# Altium project DC075B.PrjPcb (part 3 of 7)

## Sheet DC075B_LMK_CLOCK_CIRCUIT.SchDoc: LMK CLOCK CIRCUIT
size 558 x 431 mm; DrawnBy: Praveen Aroul; DocumentNumber: 4; SheetNumber: 4; SheetTotal: 13; PageSetup: Record=PageOptions|CenterHorizontal=True|CenterVertical=True|PrintScale=1.00|XCorrection=1.00|YCorrection=1.00|PrintKind=0|BorderSize=5000000|LeftOffset=0|BottomOffset=0|Orientation=2|PaperLength=1000|PaperWidth=1000|Scale=100|PaperSource=15|PrintQuality=600|MediaType=1|DitherType=10|PaperKind=Letter|PrintScaleMode=1
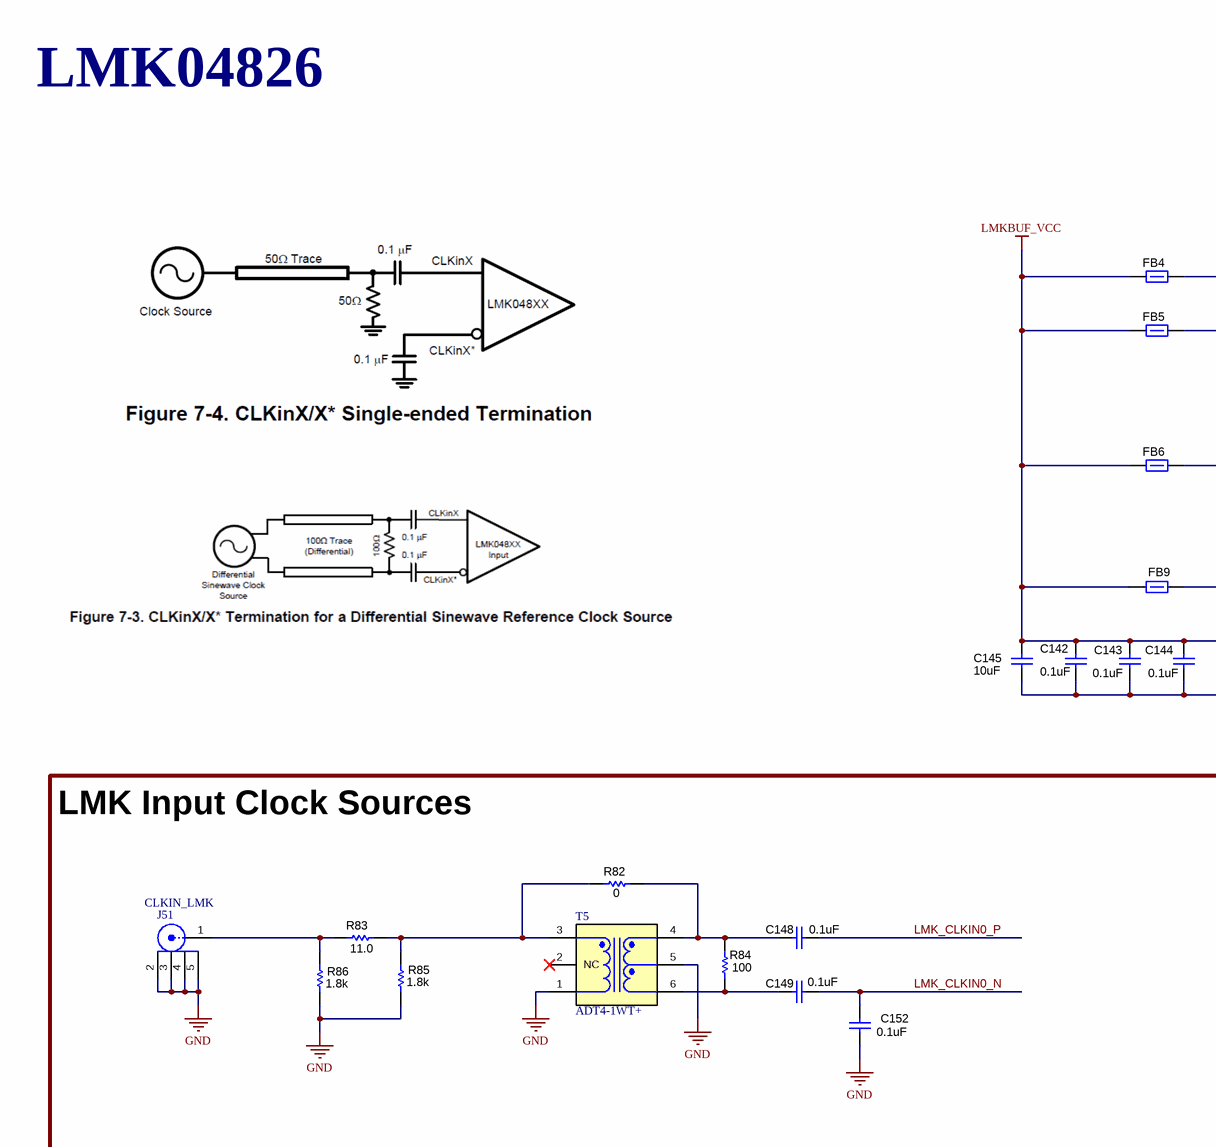
[diagram p7: DC075B_LMK_CLOCK_CIRCUIT.SchDoc, top left]
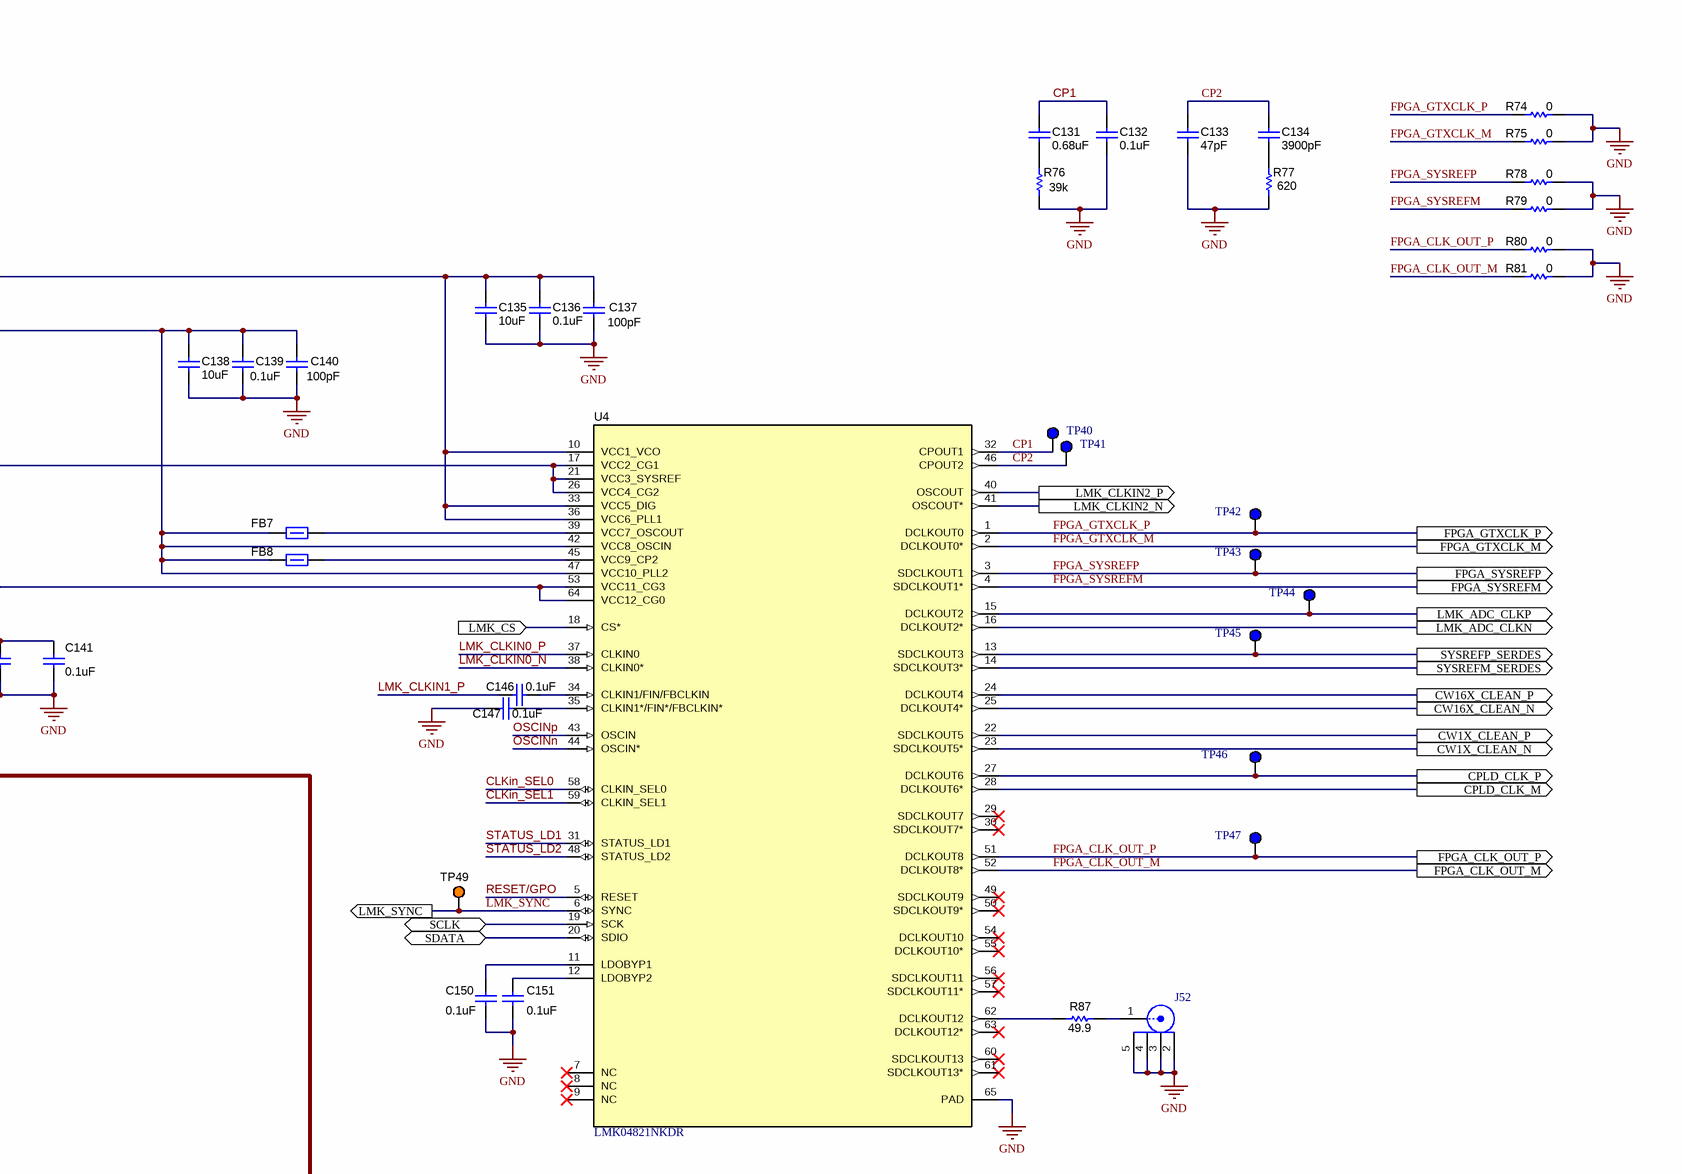
[diagram p8: DC075B_LMK_CLOCK_CIRCUIT.SchDoc, top right]
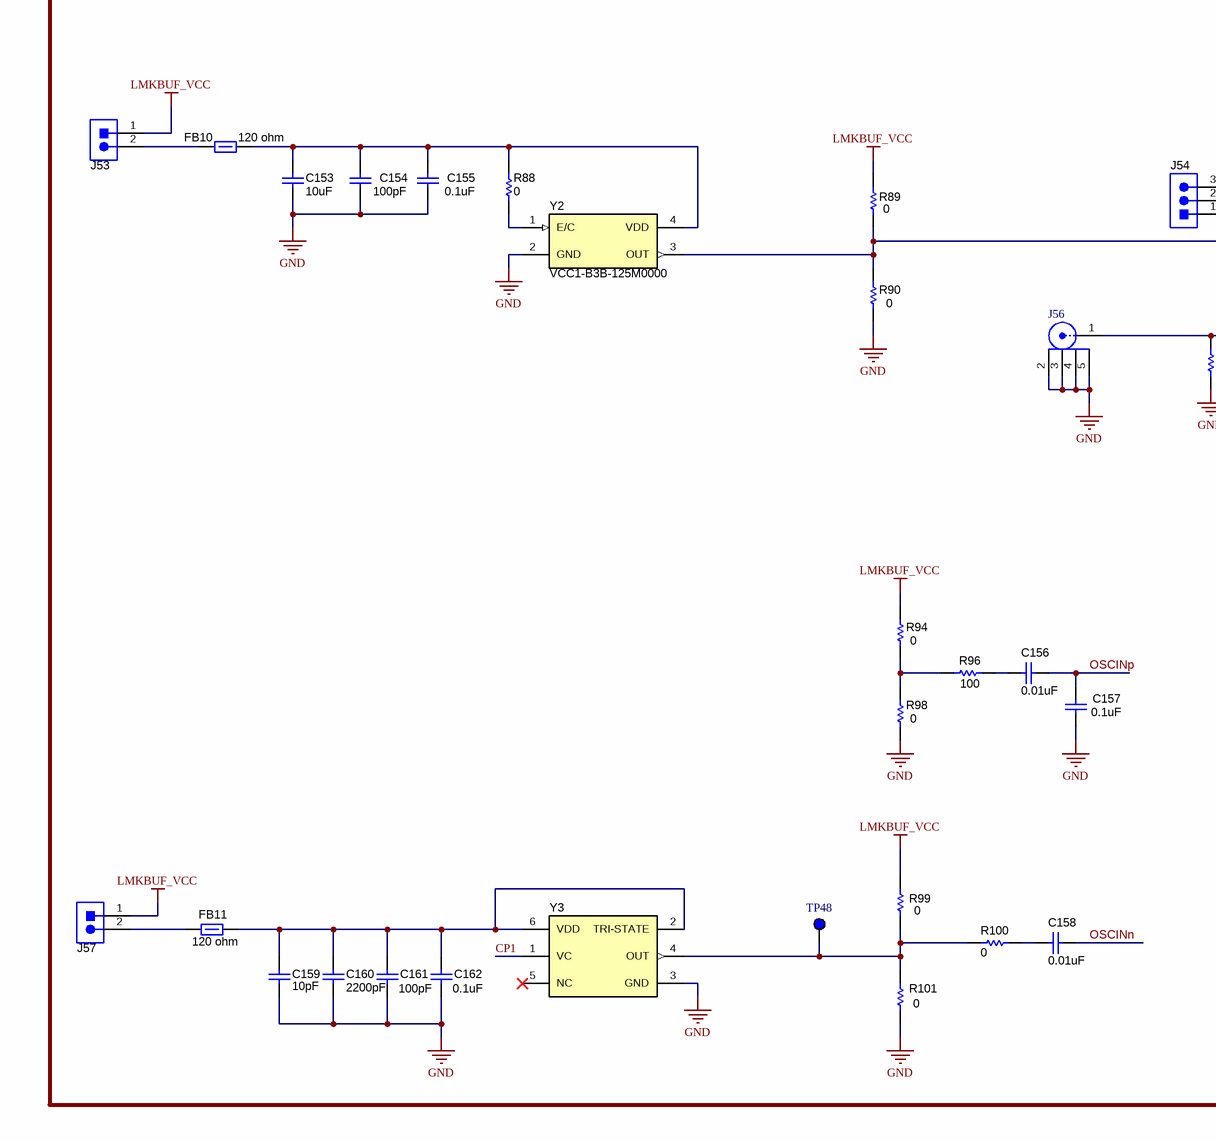
[diagram p9: DC075B_LMK_CLOCK_CIRCUIT.SchDoc, bottom left]
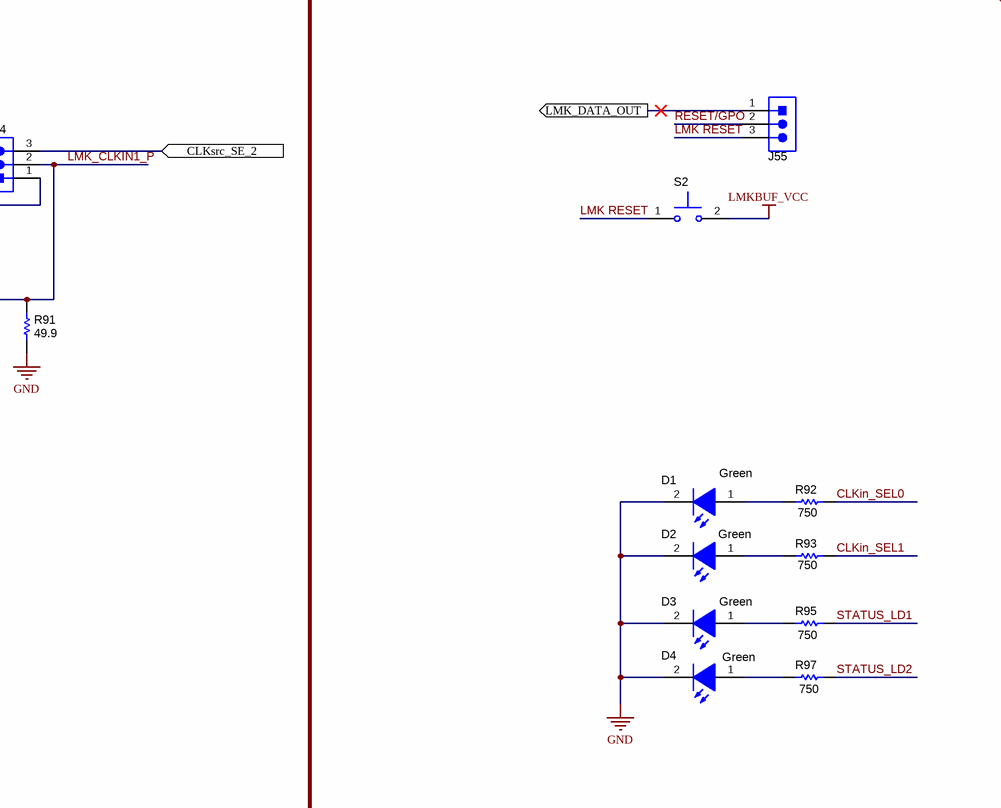
[diagram p10: DC075B_LMK_CLOCK_CIRCUIT.SchDoc, bottom right]

### Parts
C131  value 0.68uF  [0603_HV]  (hidden comment: C0603C684K8PACTU)
C132  value 0.1uF  [0402]  (hidden comment: GRM155R71C104KA88D)
C133  ValueDisplayed: 47pF  [0603]  (hidden comment: C0603C470J1GACAUTO)
C134  value 3900pF  [0402]  (hidden comment: CL05B392KB5NNNC)
C135  value 10uF  [0603_HV]  (hidden comment: GRM188R60J106ME47D)
C136  value 0.1uF  [0402]  (hidden comment: GRM155R71C104KA88D)
C137  value 100pF  [0402]  (hidden comment: CC0402KRX7R9BB101)
C138  value 10uF  [0603_HV]  (hidden comment: GRM188R60J106ME47D)
C139  value 0.1uF  [0402]  (hidden comment: GRM155R71C104KA88D)
C140  value 100pF  [0402]  (hidden comment: CC0402KRX7R9BB101)
C141  value 0.1uF  [0402]  (hidden comment: GRM155R71C104KA88D)
C142  value 0.1uF  [0402]  (hidden comment: GRM155R71C104KA88D)
C143  value 0.1uF  [0402]  (hidden comment: GRM155R71C104KA88D)
C144  value 0.1uF  [0402]  (hidden comment: GRM155R71C104KA88D)
C145  value 10uF  [0603_HV]  (hidden comment: GRM188R60J106ME47D)
C146  value 0.1uF  [0402]  (hidden comment: GRM155R71C104KA88D)
C147  value 0.1uF  [0402]  (hidden comment: GRM155R71C104KA88D)
C148  value 0.1uF  [0402]  (hidden comment: GRM155R71C104KA88D)
C149  value 0.1uF  [0402]  (hidden comment: GRM155R71C104KA88D)
C150  value 0.1uF  [0402]  (hidden comment: GRM155R71C104KA88D)
C151  value 0.1uF  [0402]  (hidden comment: GRM155R71C104KA88D)
C152  value 0.1uF  [0603_HV]  (hidden comment: 06033C104JAT2A)
C153  value 10uF  [0603_HV]  (hidden comment: GRM188R60J106ME47D)
C154  value 100pF  [0402]  (hidden comment: CC0402KRX7R9BB101)
C155  value 0.1uF  [0402]  (hidden comment: GRM155R71C104KA88D)
C156  ValueDisplayed: 0.01uF  [0402]  (hidden comment: GRM155R61C103KA01D)
C157  value 0.1uF  [0402]  (hidden comment: GRM155R71C104KA88D)
C158  ValueDisplayed: 0.01uF  [0402]  (hidden comment: GRM155R61C103KA01D)
C159  ValueDisplayed: 10pF  [0402]  (hidden comment: C0402C100C8GACTU)
C160  ValueDisplayed: 2200pF  [0402_065]  (hidden comment: 500R07W222KV4T)
C161  value 100pF  [0402]  (hidden comment: CC0402KRX7R9BB101)
C162  value 0.1uF  [0402]  (hidden comment: GRM155R71C104KA88D)
D1  value Green  [LED_LTST-C190_G]  (hidden comment: LTST-C190KGKT)
D2  value Green  [LED_LTST-C190_G]  (hidden comment: LTST-C190KGKT)
D3  value Green  [LED_LTST-C190_G]  (hidden comment: LTST-C190KGKT)
D4  value Green  [LED_LTST-C190_G]  (hidden comment: LTST-C190KGKT)
FB4  BLM21AG121SN1D  [0805]  (value not drawn)
FB5  BLM21AG121SN1D  [0805]  (value not drawn)
FB6  BLM21AG121SN1D  [0805]  (value not drawn)
FB7  BLM21AG121SN1D  [0805]  (value not drawn)
FB8  BLM21AG121SN1D  [0805]  (value not drawn)
FB9  BLM21AG121SN1D  [0805]  (value not drawn)
FB10  value 120 ohm  [1206]  (hidden comment: HI1206P121R-10)
FB11  value 120 ohm  [1206]  (hidden comment: HI1206P121R-10)
J51  5-1814832-1  [TE_5-1814832-1]  (value not drawn)
J52  5-1814832-1  [TE_5-1814832-1]  (value not drawn)
J53  TSW-102-07-G-S  [TSW-102-07-G-S]  (value not drawn)
J54  TSW-103-07-G-S  [TSW-103-07-G-S]  (value not drawn)
J55  TSW-103-07-G-S  [TSW-103-07-G-S]  (value not drawn)
J56  5-1814832-1  [TE_5-1814832-1]  (value not drawn)
J57  TSW-102-07-G-S  [TSW-102-07-G-S]  (value not drawn)
R74  value 0  [0402]  (hidden comment: CRCW04020000Z0ED)
R75  value 0  [0402]  (hidden comment: CRCW04020000Z0ED)
R76  value 39k  [0402]  (hidden comment: CRCW040239K0JNED)
R77  value 620  [0402]  (hidden comment: CRCW0402620RJNED)
R78  value 0  [0402]  (hidden comment: CRCW04020000Z0ED)
R79  value 0  [0402]  (hidden comment: CRCW04020000Z0ED)
R80  value 0  [0402]  (hidden comment: CRCW04020000Z0ED)
R81  value 0  [0402]  (hidden comment: CRCW04020000Z0ED)
R82  value 0  [0402]  (hidden comment: CRCW04020000Z0ED)
R83  value 11.0  [0402]  (hidden comment: CRCW040211R0FKED)
R84  ValueDisplayed: 100  [0402]  (hidden comment: ERJ-2RKF1000X)
R85  value 1.8k  [0402]  (hidden comment: CRCW04021K80JNED)
R86  value 1.8k  [0402]  (hidden comment: CRCW04021K80JNED)
R87  value 49.9  [0402]  (hidden comment: CRCW040249R9FKED)
R88  ValueDisplayed: 0  [0402]  (hidden comment: CRCW04020000Z0ED)
R89  value 0  [0402]  (hidden comment: CRCW04020000Z0ED)
R90  value 0  [0402]  (hidden comment: CRCW04020000Z0ED)
R91  value 49.9  [0402]  (hidden comment: CRCW040249R9FKED)
R92  value 750  [0402]  (hidden comment: CRCW0402750RJNED)
R93  value 750  [0402]  (hidden comment: CRCW0402750RJNED)
R94  value 0  [0402]  (hidden comment: CRCW04020000Z0ED)
R95  value 750  [0402]  (hidden comment: CRCW0402750RJNED)
R96  ValueDisplayed: 100  [0402]  (hidden comment: ERJ-2RKF1000X)
R97  value 750  [0402]  (hidden comment: CRCW0402750RJNED)
R98  value 0  [0402]  (hidden comment: CRCW04020000Z0ED)
R99  value 0  [0402]  (hidden comment: CRCW04020000Z0ED)
R100  ValueDisplayed: 0  [0402]  (hidden comment: CRCW04020000Z0ED)
R101  value 0  [0402]  (hidden comment: CRCW04020000Z0ED)
S2  SKRKAEE020  [SW_SKRKAE]  (value not drawn)
T5  ADT4-1WT+  [MNC_CD542]
TP40  5117  [Keystone5117]  (value not drawn)
TP41  5117  [Keystone5117]  (value not drawn)
TP42  5117  [Keystone5117]  (value not drawn)
TP43  5117  [Keystone5117]  (value not drawn)
TP44  5117  [Keystone5117]  (value not drawn)
TP45  5117  [Keystone5117]  (value not drawn)
TP46  5117  [Keystone5117]  (value not drawn)
TP47  5117  [Keystone5117]  (value not drawn)
TP48  5117  [Keystone5117]  (value not drawn)
TP49  5003  [Keystone5003]  (value not drawn)
U4  LMK04821NKDR  [NKD0064A]
Y2  VCC1-B3B-125M0000  [Vectron_VCC1]
Y3  ASVV-40.000MHZ-N102-T  [ABRACON_ASVV]  (value not drawn)

### Blocks framed on the sheet
LMK Input Clock Sources: C148 C149 C152-C162 FB10 FB11 J51 J53 J54 J56 J57 R82-R86 R88-R91 R94 R96 R98-R101 T5 TP48 Y2 Y3

### Ports
CLKsrc_SE_2 (in), CPLD_CLK_M (out), CPLD_CLK_P (out), CW1X_CLEAN_N (out), CW1X_CLEAN_P (out), CW16X_CLEAN_N (out), CW16X_CLEAN_P (out), FPGA_CLK_OUT_M (out), FPGA_CLK_OUT_P (out), FPGA_GTXCLK_M (out), FPGA_GTXCLK_P (out), FPGA_SYSREFM (out), FPGA_SYSREFP (out), LMK_ADC_CLKN (out), LMK_ADC_CLKP (out), LMK_CLKIN2_N (out), LMK_CLKIN2_P (out), LMK_CS (in), LMK_DATA_OUT (out), LMK_SYNC (out), SCLK, SDATA (bidir), SYSREFM_SERDES (out), SYSREFP_SERDES (out)

### Nets
GND: C132.1 C133.1 C135.1 C136.1 C137.1 C138.1 C139.1 C140.1 C141.1 C142.1 C143.1 C144.1 C145.1 C147.2 C150.2 C151.2 C152.2 C153.2 C154.2 C155.2 C157.2 C159.2 C160.2 C161.2 C162.2 D1.2(K) D2.2(K) D3.2(K) D4.2(K) J51.2 J51.3 J51.4 J51.5 J52.2 J52.3 J52.4 J52.5 J56.2 J56.3 J56.4 J56.5 R74.2 R75.1 R76.1 R77.1 R78.2 R79.1 R80.2 R81.1 R85.2 R86.2 R90.2 R91.2 R98.2 R101.2 T5.1 T5.5 U4.65(PAD) Y2.2(GND) Y3.3(GND)
LMKBUF_VCC: C141.2 C142.2 C143.2 C144.2 C145.2 FB4.1 FB5.1 FB6.1 FB9.1 J53.1 J57.1 R89.1 R94.1 R99.1 S2.2
CLKin_SEL0: R92.2 U4.58(CLKIN_SEL0)
CLKin_SEL1: R93.2 U4.59(CLKIN_SEL1)
CLKsrc_SE_2: J54.3 ; port CLKsrc_SE_2
CP1: C131.2 C132.2 TP40.1 U4.32(CPOUT1) Y3.1(VC)
CP2: C133.2 C134.2 TP41.1 U4.46(CPOUT2)
CPLD_CLK_M: U4.28(DCLKOUT6*) ; port CPLD_CLK_M
CPLD_CLK_P: TP46.1 U4.27(DCLKOUT6) ; port CPLD_CLK_P
CW1X_CLEAN_N: U4.23(SDCLKOUT5*) ; port CW1X_CLEAN_N
CW1X_CLEAN_P: U4.22(SDCLKOUT5) ; port CW1X_CLEAN_P
CW16X_CLEAN_N: U4.25(DCLKOUT4*) ; port CW16X_CLEAN_N
CW16X_CLEAN_P: U4.24(DCLKOUT4) ; port CW16X_CLEAN_P
FPGA_CLK_OUT_M: R81.2 U4.52(DCLKOUT8*) ; port FPGA_CLK_OUT_M
FPGA_CLK_OUT_P: R80.1 TP47.1 U4.51(DCLKOUT8) ; port FPGA_CLK_OUT_P
FPGA_GTXCLK_M: R75.2 U4.2(DCLKOUT0*) ; port FPGA_GTXCLK_M
FPGA_GTXCLK_P: R74.1 TP42.1 U4.1(DCLKOUT0) ; port FPGA_GTXCLK_P
FPGA_SYSREFM: R79.2 U4.4(SDCLKOUT1*) ; port FPGA_SYSREFM
FPGA_SYSREFP: R78.1 TP43.1 U4.3(SDCLKOUT1) ; port FPGA_SYSREFP
LMK RESET: J55.3 S2.1
LMK_ADC_CLKN: U4.16(DCLKOUT2*) ; port LMK_ADC_CLKN
LMK_ADC_CLKP: TP44.1 U4.15(DCLKOUT2) ; port LMK_ADC_CLKP
LMK_CLKIN0_N: C149.2 C152.1 U4.38(CLKIN0*)
LMK_CLKIN0_P: C148.2 U4.37(CLKIN0)
LMK_CLKIN1_P: C146.2 J54.2 J56.1 R91.1
LMK_CLKIN2_N: U4.41(OSCOUT*) ; port LMK_CLKIN2_N
LMK_CLKIN2_P: U4.40(OSCOUT) ; port LMK_CLKIN2_P
LMK_CS: U4.18(CS*) ; port LMK_CS
LMK_DATA_OUT: J55.1 ; port LMK_DATA_OUT
LMK_SYNC: TP49.1 U4.6(SYNC) ; port LMK_SYNC
OSCINn: C158.1 U4.44(OSCIN*)
OSCINp: C156.1 C157.1 U4.43(OSCIN)
RESET/GPO: J55.2 U4.5(RESET)
SCLK: U4.19(SCK) ; port SCLK
SDATA: U4.20(SDIO) ; port SDATA
STATUS_LD1: R95.2 U4.31(STATUS_LD1)
STATUS_LD2: R97.2 U4.48(STATUS_LD2)
SYSREFM_SERDES: U4.14(SDCLKOUT3*) ; port SYSREFM_SERDES
SYSREFP_SERDES: TP45.1 U4.13(SDCLKOUT3) ; port SYSREFP_SERDES
NetC131_1: C131.1 R76.2
NetC134_1: C134.1 R77.2
NetC135_2: C135.2 C136.2 C137.2 FB4.2 U4.10(VCC1_VCO) U4.33(VCC5_DIG) U4.36(VCC6_PLL1)
NetC138_2: C138.2 C139.2 C140.2 FB5.2 FB7.1 FB8.1 U4.42(VCC8_OSCIN) U4.47(VCC10_PLL2)
NetC146_1: C146.1 U4.34(CLKIN1/FIN/FBCLKIN)
NetC147_1: C147.1 U4.35(CLKIN1*/FIN*/FBCLKIN*)
NetC148_1: C148.1 R82.2 R84.2 T5.4
NetC149_1: C149.1 R84.1 T5.6
NetC150_1: C150.1 U4.11(LDOBYP1)
NetC151_1: C151.1 U4.12(LDOBYP2)
NetC153_1: C153.1 C154.1 C155.1 FB10.2 R88.1 Y2.4(VDD)
NetC156_2: C156.2 R96.1
NetC158_2: C158.2 R100.1
NetC159_1: C159.1 C160.1 C161.1 C162.1 FB11.2 Y3.2(TRI-STATE) Y3.6(VDD)
NetD1_1: D1.1(A) R92.1
NetD2_1: D2.1(A) R93.1
NetD3_1: D3.1(A) R95.1
NetD4_1: D4.1(A) R97.1
NetFB6_2: FB6.2 U4.17(VCC2_CG1) U4.21(VCC3_SYSREF) U4.26(VCC4_CG2)
NetFB7_2: FB7.2 U4.39(VCC7_OSCOUT)
NetFB8_2: FB8.2 U4.45(VCC9_CP2)
NetFB9_2: FB9.2 U4.53(VCC11_CG3) U4.64(VCC12_CG0)
NetFB10_1: FB10.1 J53.2
NetFB11_1: FB11.1 J57.2
NetJ51_1: J51.1 R83.1 R86.1
NetJ52_1: J52.1 R87.2
NetJ54_1: J54.1 R89.2 R90.1 Y2.3(OUT)
NetR82_1: R82.1 R83.2 R85.1 T5.3
NetR87_1: R87.1 U4.62(DCLKOUT12)
NetR88_2: R88.2 Y2.1(E/C)
NetR94_2: R94.2 R96.2 R98.1
NetR99_2: R99.2 R100.2 R101.1 TP48.1 Y3.4(OUT)

Not connected (* = marked no-connect by the designer): T5 2(NC)*; U4 7(NC)* 8(NC)* 9(NC)* 29(SDCLKOUT7)* 30(SDCLKOUT7*)* 49(SDCLKOUT9)* 50(SDCLKOUT9*)* 54(DCLKOUT10)* 55(DCLKOUT10*)* 56(SDCLKOUT11)* 57(SDCLKOUT11*)* 60(SDCLKOUT13)* 61(SDCLKOUT13*)* 63(DCLKOUT12*)*; Y3 5(NC)*

### Notes on the sheet
- LMK04826
- (near J51) CLKIN_LMK
- Drawn By:
- SVN Rev:
- Number:
- TID #:
- Orderable:
- Rev:
- Sheet Title:
- File:
- Project Title:
- Designed for:
- Assembly Variant:
- Mod. Date:
- Sheet:
- Size:
- of
- C
- http://www.ti.com
- Texas Instruments and/or its licensors do not warrant the accuracy or completeness of this specification or any information contained therein. Texas Instruments and/or its licensors do not warrant that this design will meet the specifications, will be suitable for your application or fit for any particular purpose, or will operate in an implementation. Texas Instruments and/or its licensors do not warrant that the design is production worthy. You should completely validate and test your design implementation to confirm the system functionality for your application.
- Engineer:
- Contact:
- © Texas Instruments

### Library data of the parts
C131 = CMP-0006965-5: CAP, CERM, 0.68 uF, 10 V, +/- 10%, X5R, 0603; Manufacturer: Kemet; Polarized: N; U/M: EA; Cap_F: 680nF; Value1: Unknown; VDC_V: 10V; TaMin_C: -55°C; TaMax_C: 85°C; Cap_Case: 0603; AEC Category: Q200; SizeArea_mm2: 1.28; SizeAreaWB_mm2: 4.68; SizeX_mm: 1.6; SizeY_mm: 0.8; SizeZ_mm: 1; CompType: Capacitor; PartNumber: C0603C684K8PACTU; PackageReference: 0603; RoHS: Y; MountType: SMT; ComponentLink1Description: Datasheet link; ComponentLink1URL: http://www.kemet.com/kemet/web/homepage/kechome.nsf/vapubfiles/F3102_Y5V.pdf/$file/F3102_Y5V.pdf; ValueDisplayed: 0.68uF; Tolerance_%: 10%; Value2: 10V; Technology: Ceramic; TempCo: X5R; Published: 2008-06-19; Publisher: Texas Instruments; LatestRevisionDate: 2017-03-09; Supplier 1: Digi-Key; Supplier Part Number 1: 399-3116-1-ND; Supplier 2: Mouser; Supplier Part Number 2: 80-C0603C684K8P; AEC Qualified: ?
C132 C136 C139 C141-C144 C146-C151 C155 C157 C162 = CMP-0006641-2: as C210 on sheet DC075B_USB; CompType: Capacitor; PartNumber: GRM155R71C104KA88D; PackageReference: 0402; RoHS: Y; MountType: SMT; ComponentLink1Description: Datasheet link; ComponentLink1URL: http://search.murata.co.jp/Ceramy/PnsearchViewAction.do?HnOFG=ON&HnNFG=ON&SEL_CNT=50&sLang=en&sKey=GRM155R71C104KA88D&x=9&y=9&search=startwith; ValueDisplayed: 0.1uF; Tolerance_%: 10%; Value2: 16V; Technology: Ceramic; TempCo: X7R; Cap_Case: 0402; Published: 2008-06-19; Publisher: Texas Instruments; LatestRevisionDate: 2017-03-09; Supplier 1: Digi-Key; Supplier Part Number 1: 490-3261-1-ND; Supplier 2: Newark; Supplier Part Number 2: 38K1647; Supplier 3: Mouser; Supplier Part Number 3: 81-GRM155R71C104KA88; AEC Qualified: ?; SizeY_mm: 0.5
C133 = CMP-0085572-1: CAP, CERM, 47 pF, 100 V,+/- 5%, C0G/NP0, AEC-Q200 Grade 1, 0603; Manufacturer: Kemet; TaMax_C: 125°C; AEC Category: Q200; AEC Grade: 1; VDC_V: 100V; TaMin_C: -55°C; SizeArea_mm2: 1.28; CompType: Capacitor; Value: 47pF; AEC Qualified: Y; Polarized: N; SizeX_mm: 1.6; U/M: EA; SizeY_mm: 0.8; SizeAreaWB_mm2: 4.68; PartNumber: C0603C470J1GACAUTO; ComponentLink1Description: Datasheet link; SizeZ_mm: 1; MountType: SMT; Technology: Ceramic; ComponentLink1URL: https://api.kemet.com/component-edge/download/specsheet/C0603C470J1GACAUTO.pdf; Tolerance_%: 5%; Value2: 100V; TempCo: C0G/NP0; Cap_F: 47pF; PackageReference: 0603; Cap_Case: 0603; RoHS: Y
C134 = CMP-0085576-2: CAP, CERM, 3900 pF, 50 V,+/- 10%, X7R, 0402; Manufacturer: Samsung Electro-Mechanics; CompType: Capacitor; Polarized: N; U/M: EA; Cap_F: 3.9nF; VDC_V: 50V; TaMin_C: -55°C; TaMax_C: 125°C; AEC Category: Q200; SizeArea_mm2: 0.5; SizeAreaWB_mm2: 3; SizeX_mm: 1; SizeZ_mm: 0.6; PartNumber: CL05B392KB5NNNC; PackageReference: 0402; RoHS: Y; MountType: SMT; ComponentLink1Description: Datasheet link; ComponentLink1URL: http://www.samsungsem.com/kr/support/product-search/mlcc/__icsFiles/afieldfile/2018/07/26/CL05B392KB5NNNC.pdf; ValueDisplayed: 3900pF; Tolerance_%: 10%; Value2: 50V; Technology: Ceramic; TempCo: X7R; Cap_Case: 0402; AEC Grade: N/A; AEC Qualified: N; SizeY_mm: 0.5
C135 C138 C145 C153 = CMP-0007303-5: CAP, CERM, 10 uF, 6.3 V, +/- 20%, X5R, 0603; Manufacturer: MuRata; Polarized: N; U/M: EA; Cap_F: 10µF; ESR_ohm: 9m; Value1: 0.009 ohm; VDC_V: 6.3V; IRMS_A: 2.74A; TaMin_C: -55°C; TaMax_C: 125°C; Cap_Case: 0603; AEC Category: Q200; SizeArea_mm2: 1.28; SizeAreaWB_mm2: 4.68; SizeX_mm: 1.6; SizeY_mm: 0.8; SizeZ_mm: 1; CompType: Capacitor; PartNumber: GRM188R60J106ME47D; PackageReference: 0603; RoHS: Y; MountType: SMT; ComponentLink1Description: Datasheet link; ComponentLink1URL: http://www.murata.com/products/capacitor/tech_data/pdf/grm188r60j106m.pdf; ValueDisplayed: 10uF; Tolerance_%: 20%; Value2: 6.3V; Technology: Ceramic; TempCo: X5R; Published: 2008-06-19; Publisher: Texas Instruments; LatestRevisionDate: 2017-03-09; Supplier 1: Digi-Key; Supplier Part Number 1: 490-3896-1-ND; Supplier 2: Mouser; Supplier Part Number 2: 81-GRM188R60J106ME47; Supplier 3: Farnell; Supplier Part Number 3: 1735528; AEC Qualified: ?
C137 C140 C154 C161 = CMP-0006305-2: CAP, CERM, 100 pF, 50 V, +/- 10%, X7R, 0402; Manufacturer: Yageo America; Polarized: N; U/M: EA; Value1: Unknown; VDC_V: 50V; TaMin_C: -55°C; TaMax_C: 125°C; AEC Category: Q200; SizeArea_mm2: 0.5; SizeAreaWB_mm2: 3; SizeX_mm: 1; SizeZ_mm: 0.6; CompType: Capacitor; PartNumber: CC0402KRX7R9BB101; ValueDisplayed: 100pF; PackageReference: 0402; RoHS: Y; Cap_F: 100pF; Tolerance_%: 10%; Value2: 50V; MountType: SMT; Technology: Ceramic; TempCo: X7R; Cap_Case: 0402; Published: 2008-06-19; Publisher: Texas Instruments; LatestRevisionDate: 2017-03-09; ComponentLink1Description: Datasheet link; ComponentLink1URL: http://www.yageo.com/documents/recent/UPY-GPHC_X7R_6.3V-to-50V_9.pdf; Supplier 1: Digi-Key; Supplier Part Number 1: 311-1419-1-ND; Supplier 2: Newark; Supplier Part Number 2: 65R7701; Supplier 3: Mouser; Supplier Part Number 3: 603-CC402KRX7R9BB101; AEC Qualified: ?; SizeY_mm: 0.5
C152 = CMP-0006752-5: CAP, CERM, 0.1 uF, 25 V, +/- 5%, X7R, 0603; Manufacturer: AVX; Polarized: N; U/M: EA; Cap_F: 100nF; ESR_ohm: 0.05; Value1: 0.05 ohm; VDC_V: 25V; TaMin_C: -55°C; TaMax_C: 125°C; Cap_Case: 0603; AEC Category: Q200; SizeArea_mm2: 1.28; SizeAreaWB_mm2: 4.68; SizeX_mm: 1.6; SizeY_mm: 0.8; SizeZ_mm: 1; CompType: Capacitor; PartNumber: 06033C104JAT2A; PackageReference: 0603; RoHS: Y; MountType: SMT; ComponentLink1Description: Datasheet link; ComponentLink1URL: http://datasheets.avx.com/X7RDielectric.pdf; ValueDisplayed: 0.1uF; Tolerance_%: 5%; Value2: 25V; Technology: Ceramic; TempCo: X7R; Published: 2008-06-19; Publisher: Texas Instruments; LatestRevisionDate: 2017-03-09; Supplier 1: Digi-Key; Supplier Part Number 1: 478-3713-1-ND; Supplier 2: Mouser; Supplier Part Number 2: 581-06033C104JAT2A; Supplier 3: Farnell; Supplier Part Number 3: 1740614; AEC Grade: N/A; AEC Qualified: N
C156 C158 = CMP-0006590-2: CAP, CERM, 0.01 uF, 16 V, +/- 10%, X5R, 0402; Manufacturer: MuRata; Polarized: N; Value: 0.01uF; U/M: EA; Cap_F: 10nF; Value1: Unknown; VDC_V: 16V; TaMin_C: -55°C; TaMax_C: 85°C; SizeArea_mm2: 0.5; SizeAreaWB_mm2: 3; SizeX_mm: 1; SizeZ_mm: 0.6; AEC Category: Q200; CompType: Capacitor; PartNumber: GRM155R61C103KA01D; PackageReference: 0402; RoHS: Y; Tolerance_%: 10%; Value2: 16V; MountType: SMT; Technology: Ceramic; TempCo: X5R; Cap_Case: 0402; Published: 2008-06-19; Publisher: Texas Instruments; LatestRevisionDate: 2017-03-09; ComponentLink1Description: Datasheet link; ComponentLink1URL: http://search.murata.co.jp/Ceramy/PnsearchViewAction.do?HnOFG=ON&HnNFG=ON&SEL_CNT=50&sLang=en&sKey=GRM155R61C103KA01D&x=9&y=9&search=startwith; Supplier 1: Digi-Key; Supplier Part Number 1: GRM155R61C103KA01D-ND; Supplier 2: Mouser; Supplier Part Number 2: 81-GRM155R61C103KA1D; SizeY_mm: 0.5; AEC Qualified: ?
C159 = CMP-0064914-2: CAP, CERM, 10 pF, 10 V,+/- 2.5%, C0G/NP0, 0402; Manufacturer: Kemet; TaMin_C: -55°C; Polarized: N; SizeAreaWB_mm2: 3; Value1: Unknown; U/M: EA; Value: 10pF; TaMax_C: 125°C; SizeZ_mm: 0.6; SizeX_mm: 1; SizeY_mm: 0.5; Value2: 10V; CompType: Capacitor; AEC Category: Q200; Supplier Part Number 2: 96Y6847; Publisher: Texas Instruments; Supplier 2: Newark; Supplier Part Number 3: 80-C0402C100C8G; TempCo: C0G/NP0; Supplier 3: Mouser; Published: 2008-06-19; RoHS: Y; MountType: SMT; Supplier 1: Digi-Key; PackageReference: 0402; Tolerance_%: 2.5%; Cap_Case: 0402; SizeArea_mm2: 0.5; LatestRevisionDate: 2017-06-05; PartNumber: C0402C100C8GACTU; AEC Qualified: N; Cap_F: 10pF; VDC_V: 10V; ComponentLink1Description: Datasheet link; AEC Grade: N/A; Supplier Part Number 1: 399-8939-1-ND; Technology: Ceramic; ComponentLink1URL: http://www.kemet.com/docfinder?Partnumber=C0402C100C8GACTU
C160 = CMP-0085570-1: CAP, CERM, 2200 pF, 50 V,+/- 10%, X7R, 0402; Manufacturer: Johanson Technology; Polarized: N; Value: 2200pF; U/M: EA; Cap_F: 2.2nF; VDC_V: 50V; TaMin_C: -55°C; TaMax_C: 125°C; Cap_Case: 0402; AEC Category: Q200; SizeArea_mm2: 0.5; SizeAreaWB_mm2: 3; SizeX_mm: 1; SizeZ_mm: 0.65; CompType: Capacitor; PartNumber: 500R07W222KV4T; PackageReference: 0402; RoHS: Y; Tolerance_%: 10%; Value2: 50V; MountType: SMT; Technology: Ceramic; TempCo: X7R; ComponentLink1Description: Datasheet link; ComponentLink1URL: https://www.johansondielectrics.com/downloads/jdi-product-catalog.pdf; AEC Grade: N/A; AEC Qualified: N; SizeY_mm: 0.5
D1-D4 = CMP-0002840-2: LED, Green, SMD; Manufacturer: Lite-On; Type: AlInGaP; Vf_V: 2V; Io_A: 30mA; Tjmax_C: 85°C; Value1: W; CompType: LED; MountType: SMT; ComponentLink1URL: http://optoelectronics.liteon.com/en-us/api/DwonloadFileHandler.ashx?txtSpecNo=DS22-2000-074&txtPartNo=LTST-C190KGKT; ComponentLink1Description: Datasheet link; PackageReference: 1.6x0.8x0.8mm; PartNumber: LTST-C190KGKT; RoHS: Y; Value2: 2V; Color: green
FB4-FB9 = CMP-0003358-1: as FB15 on sheet DC075B_POWER_SUPPLIES; ComponentLink1Description: Datasheet link; ComponentLink1URL: http://search.murata.co.jp/Ceramy/image/img/PDF/ENG/L0110S0100BLM21A.pdf; CompType: Ferrite Bead; MountType: SMT; PackageReference: 0805; PartNumber: BLM21AG121SN1D; RoHS: Y; Published: 2014-04-30; Publisher: Texas Instruments; LatestRevisionDate: 2017-03-09; Supplier 1: Digi-Key; Supplier Part Number 1: 490-1038-1-ND; Supplier 2: Newark; Supplier Part Number 2: 73M9128; Supplier 3: Mouser; Supplier Part Number 3: 81-BLM21AG121SN1D; ValueDisplayed: 120 ohm
FB10 FB11 = CMP-0003380-1: Ferrite Bead, 120 ohm @ 100 MHz, 4 A, 1206; Manufacturer: Laird-Signal Integrity Products; Imax_A: 4A; DCR_ohm: 0.03; Value1: 0.03 ohm; ZTyp@100MHz_Ohm: 120; Ztyp@1GHz_Ohm: 105; SizeArea_mm2: 5.12; SizeAreaWB_mm2: 10.92; SizeX_mm: 3.2; SizeY_mm: 1.6; SizeZ_mm: 1.35; ComponentLink1Description: Datasheet link; ComponentLink1URL: http://www.lairdtech.com/DownloadAsset.aspx?id=4849; CompType: Ferrite Bead; MountType: SMT; PackageReference: 1206; PartNumber: HI1206P121R-10; RoHS: Y; Value2: 4A; Published: 2014-04-30; Publisher: Texas Instruments; LatestRevisionDate: 2017-03-09; Supplier 1: Digi-Key; Supplier Part Number 1: 240-2410-1-ND; Supplier 2: Mouser; Supplier Part Number 2: 875-HI1206P121R-10; ValueDisplayed: 120 ohm
J51 J52 J56 = CMP-0054990-1: as J39 on sheet DC075B_INPUT_CLOCKS; PartNumber: 5-1814832-1; PackageReference: SMA Straight PCB Socket Die Cast, TH; CompType: SMA; RoHS: Y; MountType: TH; ComponentLink1Description: Datasheet URL; ComponentLink1URL: http://www.te.com/commerce/DocumentDelivery/DDEController?Action=srchrtrv&DocNm=1814832&DocType=Customer+Drawing&DocLang=English; Supplier 1: Digi-Key; Supplier Part Number 1: A97594-ND; Supplier 2: Newark; Supplier Part Number 2: 78M7270; Supplier 3: Mouser; Supplier Part Number 3: 571-5-1814832-1; Green_EU RoHS-2: Incomplete; Green_EU RoHS: Passed with Exemption; Publisher: Texas Instruments; LatestRevisionDate: 26/05/2017
J53 J57 = CMP-0075405-2: as J41 on sheet DC075B_INPUT_CLOCKS; PartNumber: TSW-102-07-G-S; ClassName: Header; PackageReference: 2x1 Header; CompType: Header; RoHS: Y; MountType: TH; ComponentLink1Description: Datasheet URL; ComponentLink1URL: http://samtec.com/ftppub/pdf/TSW_TH.PDF; Supplier 1: Digi-Key; Supplier Part Number 1: SAM1029-02-ND; Cert_UL: Y; Cert_VDE: N; Color: Black; ContactFinish: Gold; Green_EU RoHS-2: Passed; Green_EU RoHS: Passed; Orientation: Vertical; PinCount: 2; Shrouded: N
J54 J55 = CMP-0075407-2: as J63 on sheet DC075B_POWER_SUPPLIES; PartNumber: TSW-103-07-G-S; PackageReference: 3x1 Header; ClassName: Header; CompType: Header; RoHS: Y; MountType: TH; ComponentLink1Description: Datasheet URL; ComponentLink1URL: http://samtec.com/ftppub/pdf/TSW_TH.PDF; Supplier 1: Digi-Key; Supplier Part Number 1: SAM1029-03-ND; Cert_UL: Y; Cert_VDE: N; Color: Black; ContactFinish: Gold; Green_EU RoHS-2: Passed; Green_EU RoHS: Passed; Orientation: Vertical; PinCount: 3; Shrouded: N
R74 R75 R78-R82 R89 R90 R94 R98 R99 R101 = CMP-0026822-3: as R102 on sheet DC075B_USB; ComponentLink1Description: Datasheet link; ComponentLink1URL: http://www.vishay.com/docs/20035/dcrcwe3.pdf; CompType: Resistor; MountType: SMT; PackageReference: 0402; PartNumber: CRCW04020000Z0ED; RoHS: E; ValueDisplayed: 0; Res_ohm: 0; Tolerance_%: 5%; Value1: 5%; Technology: Thick Film; Supplier 1: Digi-Key; Supplier Part Number 1: 541-0.0JCT-ND; Supplier 2: Newark; Supplier Part Number 2: 52K6543; Supplier 3: Mouser; Supplier Part Number 3: 71-CRCW0402-0-E3; AEC Grade: 0; SizeY_mm: 0.5
R76 = CMP-0026915-3: RES, 39 k, 5%, 0.063 W, AEC-Q200 Grade 0, 0402; Manufacturer: Vishay-Dale; Value_Code: 39k0; Power_W: 63mW; Value2: 0.063W; VDC_V: 50V; TempCo: 200 ppm/C; EIA_Code: E24; AEC Category: Q200; AEC Grade: 0; AEC Qualified: Y; SizeArea_mm2: 0.5; SizeX_mm: 1; SizeZ_mm: 0.6; ComponentLink1Description: Datasheet link; ComponentLink1URL: http://www.vishay.com/docs/20035/dcrcwe3.pdf; CompType: Resistor; MountType: SMT; PackageReference: 0402; PartNumber: CRCW040239K0JNED; RoHS: E; ValueDisplayed: 39k; Res_ohm: 39k; Tolerance_%: 5%; Value1: 5%; Technology: Thick Film; Supplier 1: Digi-Key; Supplier Part Number 1: 541-39KJCT-ND; Supplier 2: Newark; Supplier Part Number 2: 59M6729; Supplier 3: Mouser; Supplier Part Number 3: 71-CRCW0402J-39K-E3; SizeY_mm: 0.5
R77 = CMP-0026958-3: RES, 620, 5%, 0.063 W, AEC-Q200 Grade 0, 0402; Manufacturer: Vishay-Dale; Value_Code: 620R; Power_W: 63mW; Value2: 0.063W; VDC_V: 50V; TempCo: 200 ppm/C; EIA_Code: E24; AEC Category: Q200; AEC Grade: 0; AEC Qualified: Y; SizeArea_mm2: 0.5; SizeX_mm: 1; SizeZ_mm: 0.6; ComponentLink1Description: Datasheet link; ComponentLink1URL: http://www.vishay.com/docs/20035/dcrcwe3.pdf; CompType: Resistor; MountType: SMT; PackageReference: 0402; PartNumber: CRCW0402620RJNED; RoHS: E; ValueDisplayed: 620; Res_ohm: 620; Tolerance_%: 5%; Value1: 5%; Technology: Thick Film; Supplier 1: Digi-Key; Supplier Part Number 1: 541-620JCT-ND; Supplier 2: Mouser; Supplier Part Number 2: 71-CRCW0402J-620-E3; SizeY_mm: 0.5
R83 = CMP-0025979-3: RES, 11.0, 1%, 0.063 W, AEC-Q200 Grade 0, 0402; Manufacturer: Vishay-Dale; Res_ohm: 11; Value_Code: 11R0; Power_W: 63mW; Value2: 0.063W; VDC_V: 50V; TempCo: 100 ppm/C; EIA_Code: E96; AEC Category: Q200; AEC Grade: 0; AEC Qualified: Y; SizeArea_mm2: 0.5; SizeX_mm: 1; SizeZ_mm: 0.6; ComponentLink1Description: Datasheet link; ComponentLink1URL: http://www.vishay.com/docs/20035/dcrcwe3.pdf; CompType: Resistor; MountType: SMT; PackageReference: 0402; PartNumber: CRCW040211R0FKED; RoHS: E; ValueDisplayed: 11.0; Tolerance_%: 1%; Value1: 1%; Technology: Thick Film; Supplier 1: Digi-Key; Supplier Part Number 1: 541-11.0LCT-ND; Supplier 2: Newark; Supplier Part Number 2: 52K6626; Supplier 3: Mouser; Supplier Part Number 3: 71-CRCW0402-11-E3; SizeY_mm: 0.5
R84 R96 = CMP-0026656-1: RES, 100, 1%, 0.1 W, 0402; Manufacturer: Panasonic; Value: 100; Value_Code: 100R; Power_W: 100mW; Value2: 0.1W; VDC_V: 50V; TempCo: 100 ppm/C; EIA_Code: E96; U/M: EA; AEC Category: Q200; SizeArea_mm2: 0.5; SizeX_mm: 1; SizeZ_mm: 0.6; ComponentLink1Description: Datasheet link; ComponentLink1URL: http://industrial.panasonic.com/www-data/pdf/AOA0000/AOA0000CE2.pdf; CompType: Resistor; MountType: SMT; PackageReference: 0402; PartNumber: ERJ-2RKF1000X; RoHS: Y; Res_ohm: 100; Tolerance_%: 1%; Value1: 1%; Technology: Thick Film; Published: 2008-06-26; Publisher: Texas Instruments; LatestRevisionDate: 2017-03-09; Supplier 1: Digi-Key; Supplier Part Number 1: P100LCT-ND; Supplier 2: Newark; Supplier Part Number 2: 64R5246; Supplier 3: Mouser; Supplier Part Number 3: 667-ERJ-2RKF1000X; AEC Qualified: ?; SizeY_mm: 0.5
R85 R86 = CMP-0026858-5: RES, 1.8 k, 5%, 0.063 W, AEC-Q200 Grade 0, 0402; Manufacturer: Vishay-Dale; Value_Code: 1k80; Power_W: 63mW; Value2: 0.063W; VDC_V: 50V; TempCo: 200 ppm/C; EIA_Code: E24; AEC Category: Q200; AEC Grade: 0; AEC Qualified: Y; SizeArea_mm2: 0.5; SizeX_mm: 1; SizeZ_mm: 0.6; ComponentLink1Description: Datasheet link; ComponentLink1URL: http://www.vishay.com/docs/20035/dcrcwe3.pdf; CompType: Resistor; MountType: SMT; PackageReference: 0402; PartNumber: CRCW04021K80JNED; RoHS: E; ValueDisplayed: 1.8k; Res_ohm: 1.8k; Tolerance_%: 5%; Value1: 5%; Technology: Thick Film; Supplier 1: Digi-Key; Supplier Part Number 1: 541-1.8KJCT-ND; Supplier 2: Newark; Supplier Part Number 2: 89M6592; Supplier 3: Mouser; Supplier Part Number 3: 71-CRCW0402J-1.8K-E3; SizeY_mm: 0.5
R87 R91 = CMP-0026404-2: RES, 49.9, 1%, 0.063 W, AEC-Q200 Grade 0, 0402; Manufacturer: Vishay-Dale; Value_Code: 49R9; Power_W: 63mW; Value2: 0.063W; VDC_V: 50V; TempCo: 100 ppm/C; EIA_Code: E96; AEC Category: Q200; AEC Grade: 0; AEC Qualified: Y; SizeArea_mm2: 0.5; SizeX_mm: 1; SizeZ_mm: 0.6; ComponentLink1Description: Datasheet link; ComponentLink1URL: http://www.vishay.com/docs/20035/dcrcwe3.pdf; CompType: Resistor; MountType: SMT; PackageReference: 0402; PartNumber: CRCW040249R9FKED; RoHS: E; ValueDisplayed: 49.9; Res_ohm: 49.9; Tolerance_%: 1%; Value1: 1%; Technology: Thick Film; Supplier 1: Digi-Key; Supplier Part Number 1: 541-49.9LCT-ND; Supplier 2: Newark; Supplier Part Number 2: 52K7114; Supplier 3: Mouser; Supplier Part Number 3: 71-CRCW0402-49.9-E3; SizeY_mm: 0.5
R88 = CMP-0026822-3: RES, 0, 5%, 0.063 W, AEC-Q200 Grade 0, 0402; Manufacturer: Vishay-Dale; Value: 0; Value_Code: 0000; Power_W: 63mW; Value2: 0.063W; VDC_V: 50V; TempCo: 200 ppm/C; EIA_Code: E24; AEC Category: Q200; AEC Qualified: Y; SizeArea_mm2: 0.5; SizeX_mm: 1; SizeZ_mm: 0.6; CompType: Resistor; PartNumber: CRCW04020000Z0ED; PackageReference: 0402; RoHS: E; Res_ohm: 0; Tolerance_%: 5%; Value1: 5%; MountType: SMT; Technology: Thick Film; ComponentLink1Description: Datasheet link; ComponentLink1URL: http://www.vishay.com/docs/20035/dcrcwe3.pdf; Supplier 1: Digi-Key; Supplier Part Number 1: 541-0.0JCT-ND; Supplier 2: Newark; Supplier Part Number 2: 52K6543; Supplier 3: Mouser; Supplier Part Number 3: 71-CRCW0402-0-E3; AEC Grade: 0; SizeY_mm: 0.5
R92 R93 R95 R97 = CMP-0026972-3: RES, 750, 5%, 0.063 W, AEC-Q200 Grade 0, 0402; Manufacturer: Vishay-Dale; Value_Code: 750R; Power_W: 63mW; Value2: 0.063W; VDC_V: 50V; TempCo: 200 ppm/C; EIA_Code: E24; AEC Category: Q200; AEC Grade: 0; AEC Qualified: Y; SizeArea_mm2: 0.5; SizeX_mm: 1; SizeZ_mm: 0.6; ComponentLink1Description: Datasheet link; ComponentLink1URL: http://www.vishay.com/docs/20035/dcrcwe3.pdf; CompType: Resistor; MountType: SMT; PackageReference: 0402; PartNumber: CRCW0402750RJNED; RoHS: E; ValueDisplayed: 750; Res_ohm: 750; Tolerance_%: 5%; Value1: 5%; Technology: Thick Film; Supplier 1: Digi-Key; Supplier Part Number 1: 541-750JCT-ND; Supplier 2: Newark; Supplier Part Number 2: 59M6746; Supplier 3: Mouser; Supplier Part Number 3: 71-CRCW0402J-750-E3; SizeY_mm: 0.5
R100 = CMP-0026822-3: RES, 0, 5%, 0.063 W, AEC-Q200 Grade 0, 0402; Manufacturer: Vishay-Dale; Value: 0; Value_Code: 0000; Power_W: 63mW; Value2: 0.063W; VDC_V: 50V; TempCo: 200 ppm/C; EIA_Code: E24; SizeArea_mm2: 0.5; SizeX_mm: 1; SizeZ_mm: 0.6; AEC Category: Q200; AEC Qualified: Y; ComponentLink1Description: Datasheet link; ComponentLink1URL: http://www.vishay.com/docs/20035/dcrcwe3.pdf; CompType: Resistor; MountType: SMT; PackageReference: 0402; PartNumber: CRCW04020000Z0ED; RoHS: E; Res_ohm: 0; Tolerance_%: 5%; Value1: 5%; Technology: Thick Film; Supplier 1: Digi-Key; Supplier Part Number 1: 541-0.0JCT-ND; Supplier 2: Newark; Supplier Part Number 2: 52K6543; Supplier 3: Mouser; Supplier Part Number 3: 71-CRCW0402-0-E3; SizeY_mm: 0.5; AEC Grade: 0
S2 = CMP-0085606-1: Switch, SPST-NO, 0.05 A, 12 VDC, SMT; Manufacturer: Alps; VDC_V: 12V; PositionCount: 1; CurrentRating_mA: 50A; SizeArea_mm2: 13.92; SizeAreaWB_mm2: 22.62; SizeX_mm: 4.8; SizeY_mm: 2.9; SizeZ_mm: 2.2; PartNumber: SKRKAEE020; MountType: SMT; ComponentLink1Description: Datasheet URL; ComponentLink1URL: https://www.alps.com/prod/info/E/HTML/Tact/SurfaceMount/SKRK/SKRKAEE020.html; RoHS: Y; Circuit: SPST-NO; Orientation: Top Actuated; CompType: Switch; PackageReference: 3.9x2.9mm; Publisher: Texas Instruments; LatestRevisionDate: 2018-11-05
T5 = CMP-0030461-2: as T2 on sheet DC075B_INPUT_CLOCKS; PartNumber: ADT4-1WT+; CompType: Transformer; PackageReference: CD542; MountType: SMT; RoHS: Y; ComponentLink1Description: Datasheet URL; ComponentLink1URL: http://www.minicircuits.com/pdfs/ADT4-1WT.pdf; Publisher: Texas Instruments; LatestRevisionDate: 2017-05-09; Green_EU RoHS-2: Incomplete; Green_EU RoHS: Incomplete
TP40-TP48 = CMP-0055154-1: Test Point, Miniature, Blue, TH; Manufacturer: Keystone; CNHeader: FALSE; ContactFinish: Silver; CT: TRUE; Green_Lifecycle: Active; Green_REACh: Passed; RoHS: Y; CompType: Test Point; PartNumber: 5117; PackageReference: Blue Miniature Testpoint; ComponentLink1Description: Datasheet URL; ComponentLink1URL: http://www.keyelco.com/userAssets/file/M60-2p60.pdf; Supplier 1: Digi-Key; Supplier Part Number 1: 36-5117-ND; MountType: TH; Publisher: Texas Instruments; LatestRevisionDate: 26/05/2017; Supplier 2: Newark; Supplier Part Number 2: 95M2479; Supplier 3: Mouser; Supplier Part Number 3: 534-5117; Color: Blue; Green_EU RoHS-2: Incomplete; Green_EU RoHS: Passed
TP49 = CMP-0055140-1: Test Point, Miniature, Orange, TH; Manufacturer: Keystone; CNHeader: FALSE; ContactFinish: Silver; CT: TRUE; Green_Lifecycle: Active; Green_REACh: Passed; PartNumber: 5003; PackageReference: Orange Miniature Testpoint; CompType: Test Point; RoHS: Y; MountType: TH; ComponentLink1Description: Datasheet URL; ComponentLink1URL: http://www.keyelco.com/userAssets/file/M60-2p60.pdf; Publisher: Texas Instruments; LatestRevisionDate: 26/05/2017; Supplier 1: Digi-Key; Supplier Part Number 1: 36-5003-ND; Supplier 2: Mouser; Supplier Part Number 2: 534-5003; Color: Orange; Green_EU RoHS-2: Incomplete; Green_EU RoHS: Passed
U4 = CMP-0074432-2: Ultra Low Jitter Synthesizer and Jitter Cleaner with JESD204B Support, NKD0064A (WQFN-64); Alternate PartNumber: LMK04821NKDT; Manufacturer: Texas Instruments; CompType: IC; SizeArea_mm2: 81.0; SizeAreaWB_mm2: 121.0; SizeX_mm: 9.0; SizeZ_mm: 0.8; Green_Lifecycle: Active; Green_REACh: Passed; AEC Category: Q200; AEC Qualified: N; Rating: Catalog; PartNumber: LMK04821NKDR; PackageReference: NKD0064A; MountType: SMT; ComponentLink1Description: Datasheet Link; ComponentLink1URL: http://www.ti.com/lit/ds/symlink/lmk04821.pdf; RoHS: Y; Alternate Manufacturer: Texas Instruments; PackageDescription: WQFN-64; SizeY_mm: 9.0; Green_EU RoHS: Passed; Green_EU RoHS-2: Passed; ComponentLink2Description: Product Folder; ComponentLink2URL: http://www.ti.com/product/lmk04821; ComponentLink3Description: Online Datasheet; ComponentLink3URL: http://www.ti.com/product/lmk04821/datasheet; Operating Temperature Range: -40 to 85 C
Y2 = CMP-0006076-4: OSC, 3.3 V, 125 MHz, 15 pF, SMD; Manufacturer: Microsemi; CompType: Oscillator; TaMin_C: -10°C; TaMax_C: 70°C; Frequency Stability: +/-50ppm; AEC Category: Q200; AEC Qualified: N; Frequency_Fixed: 125MHz; PartNumber: VCC1-B3B-125M0000; PackageReference: 7x5mm; MountType: SMT; RoHS: Y; ComponentLink1Description: Datasheet Link; ComponentLink1URL: https://www.microsemi.com/document-portal/doc_download/1243793-vcc1; AEC Grade: N/A
Y3 = CMP-0006079-3: OSC, 40 MHz, 3.3V, SMD; Manufacturer: Abracon Corporation; CompType: Oscillator; TaMin_C: 0°C; TaMax_C: 70°C; Frequency Stability: +/-50ppm; Frequency_Fixed: 40MHz; PartNumber: ASVV-40.000MHZ-N102-T; PackageReference: 7x5mm; MountType: SMT; RoHS: Y; ComponentLink1Description: Datasheet Link; ComponentLink1URL: http://www.abracon.com/Oscillators/ASVV.pdf; Supplier 1: Digi-Key; Supplier Part Number 1: 535-9349-1-ND; REACh: Y